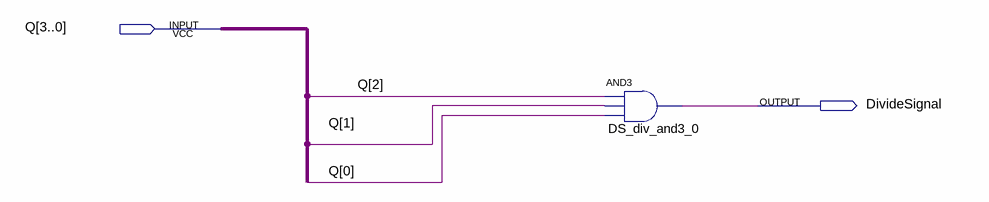
[diagram p0: schematic sheet]
// Quartus schematic DivideSignal_Divison.bdf as structural Verilog: 1 symbols, 2 pins
module DivideSignal_Divison (
  input  [3:0] Q,
  output DivideSignal
);

  and DS_div_and3_0 (DivideSignal, Q[2], Q[1], Q[0]);
endmodule
